# EasyEDA schematic SCH_task_B_2026-06-26.json
TITLE: Sheet_1; REV: 1.0; Date: 2026-06-25; Sheet: 1/1; Drawn By: 2001012; Company: Your Company
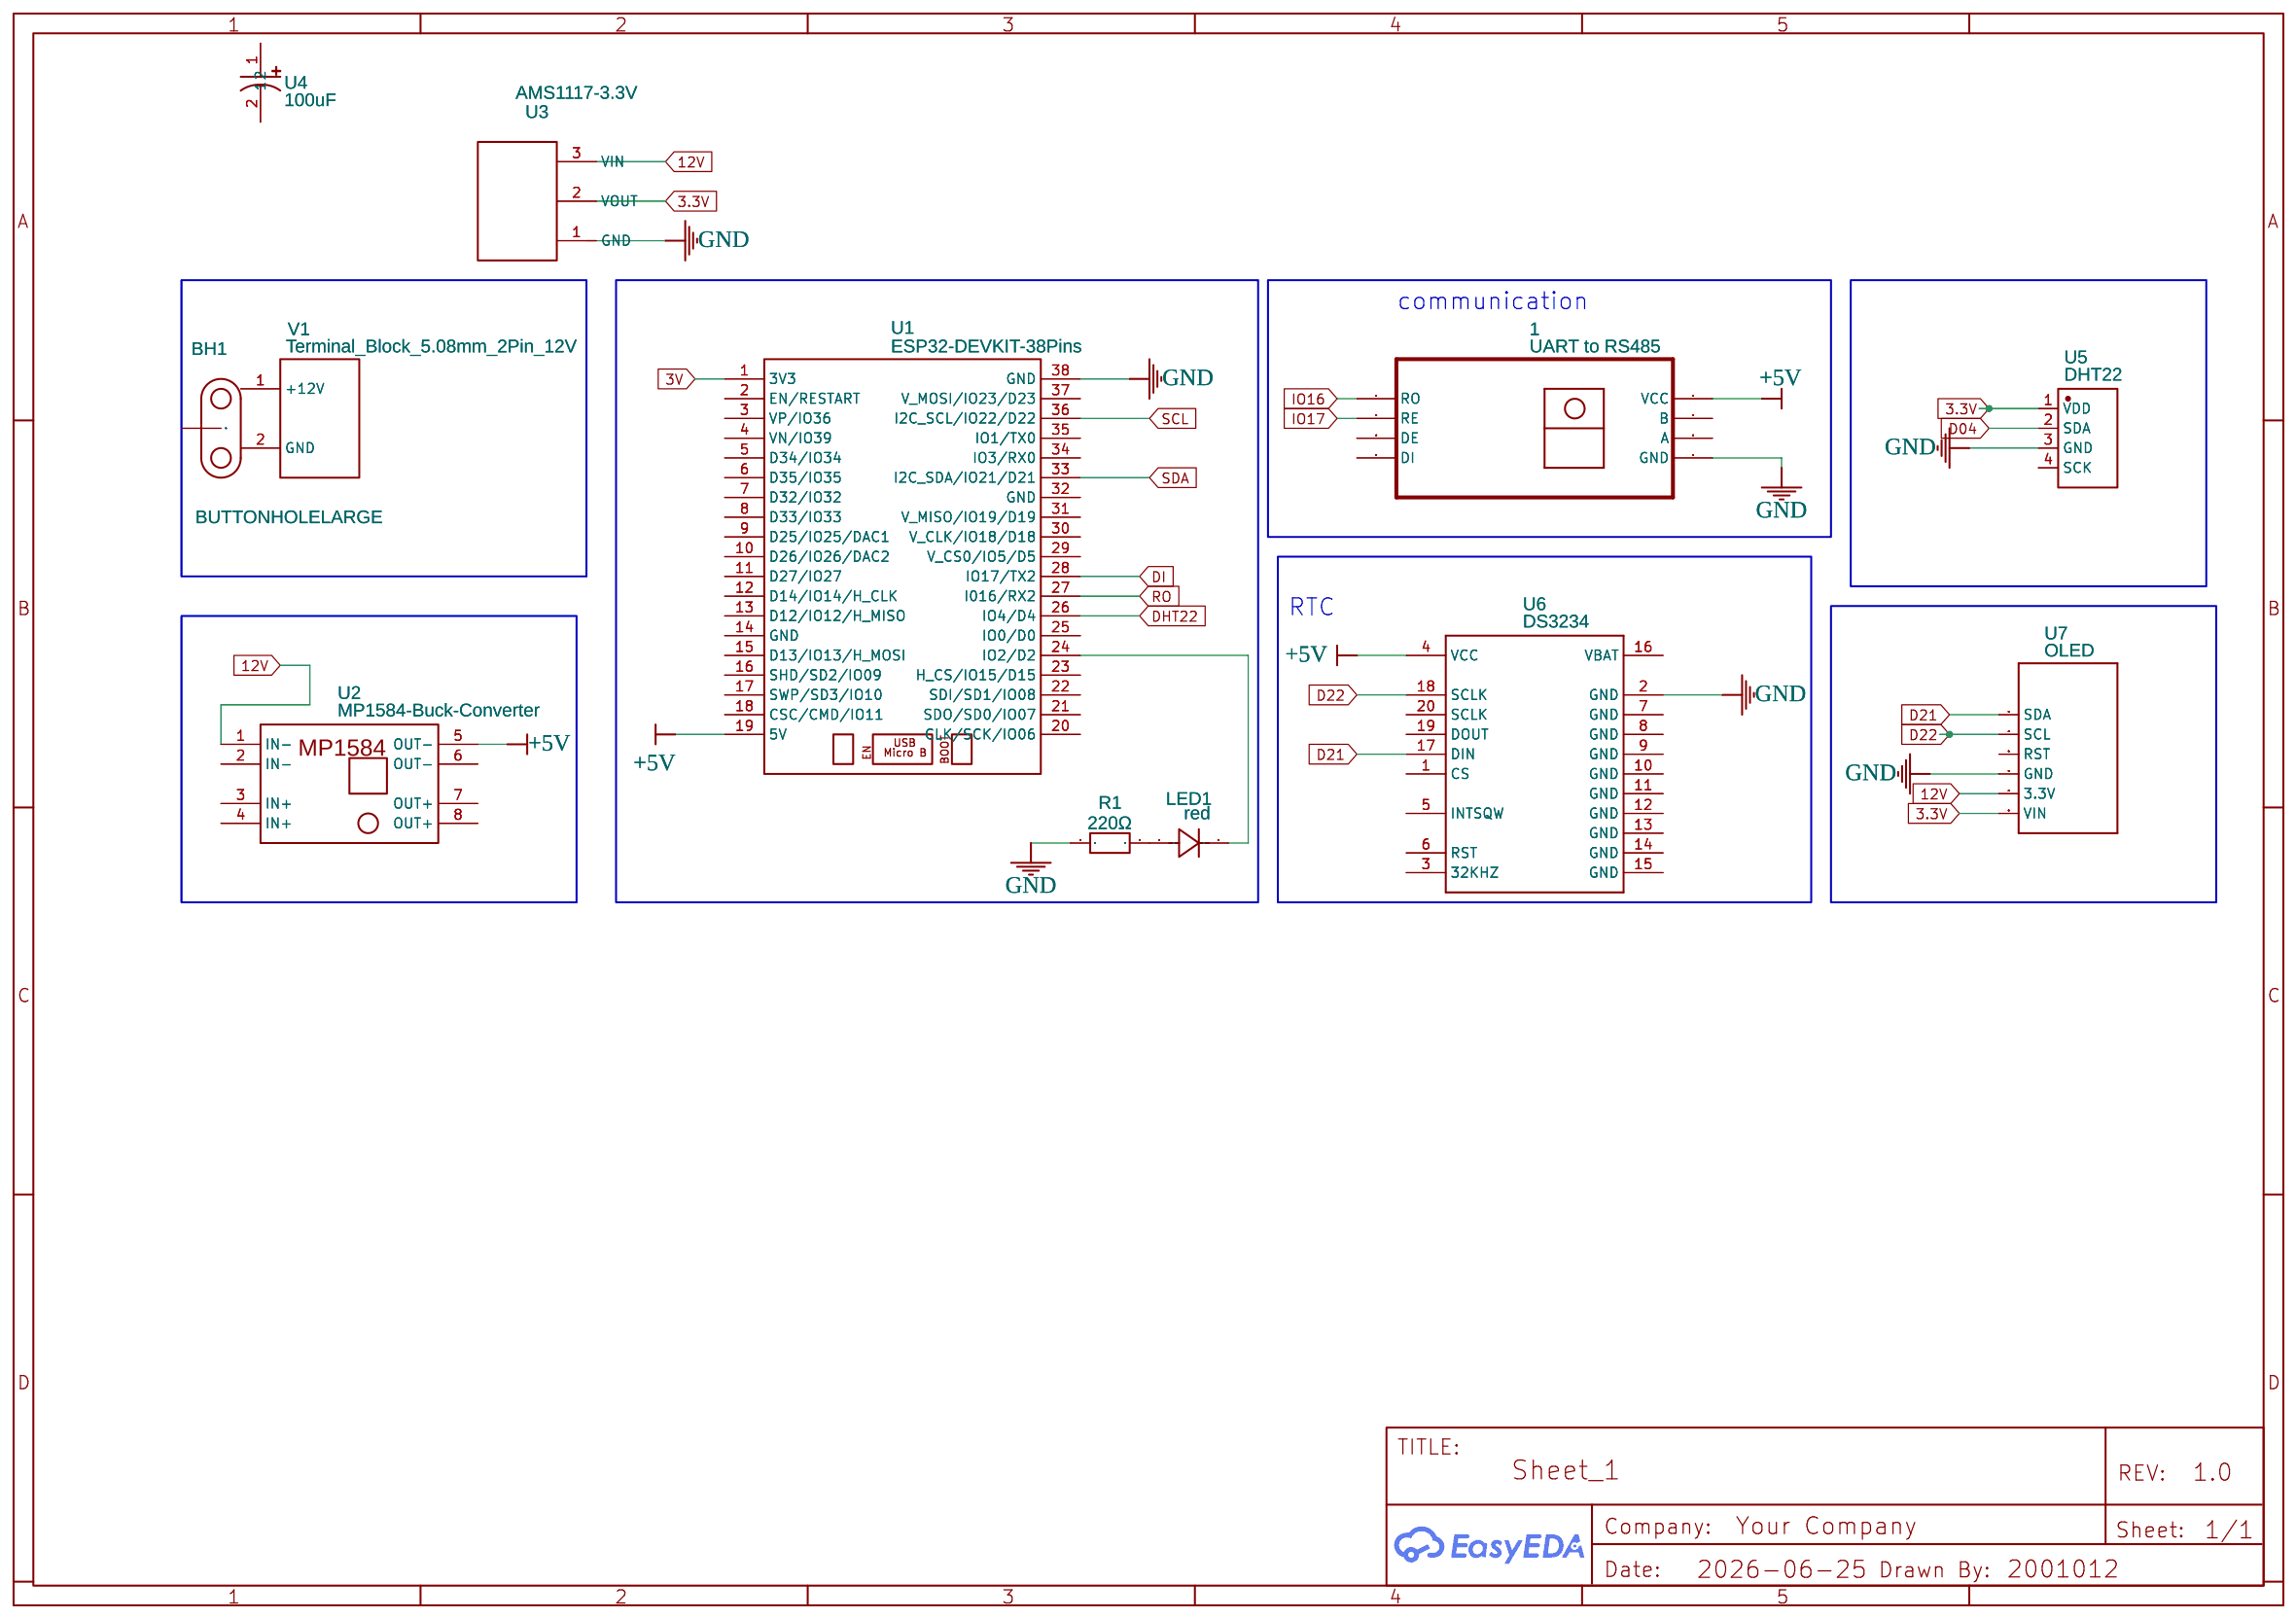
[diagram p0: schematic sheet]

## Parts
1  UART to RS485  [RS485]
BH1  BUTTONHOLELARGE  [BUTTONHOLE]
LED1  red  [LED-SMD_YLED0402O]
R1  220Ω  [RES-SMD_L28.6-W12.0_OHMITE_RWS10]
U1  ESP32-DEVKIT-38Pins  [ESP32-DEVKIT-38PINS]
U2  MP1584-Buck-Converter  [MP1584EN-BUCK-CONVERTER]
U3  AMS1117-3.3V  [3.3V STEP-UP VOLTAGE REGULATOR NCP1402]
U4  100uF  [100UF-D5XL11MM-HORN-TYPE-POLAR-ELECTROLYTIC-CAPACITORS-FP]
U5  DHT22  [SENSOR-TH_HAIGU_DHT22]
U6  DS3234  [DS3234]
U7  OLED  [ADAFRUIT_OLED_128X32]
V1  Terminal_Block_5.08mm_2Pin_12V  [TERMINAL_BLOCK_5.08MM_2PIN_12V_M2]

## Library data of the parts
1 = UART to RS485: Contributor: KM
BH1 = BUTTONHOLELARGE: Contributor: SparkFun
LED1 = YLED0402O: Supplier: LCSC; Supplier Part: C28310436; Manufacturer: YONGYUTAI(永裕泰); JLCPCB Part Class: Extended Part; Contributor: lcsc
R1 = RWS10 220R J TR: Supplier: LCSC; Supplier Part: C6460769; Manufacturer: Ohmite; Contributor: lcsc; JLCPCB Part Class: Extended Part
U1 = ESP32-DEVKIT-38Pins: Contributor: chrisjbagley
U2 = MP1584-Buck-Converter: Manufacturer Part: MP1584EN; Contributor: hirukasl6
U3 = AMS1117-3.3V: Contributor: mjlsabran
U4 = 100UF-D5XL11MM-HORN-TYPE-POLAR-ELECTROLYTIC-CAPACITORS COPY: Contributor: aades2204; Supplier: LCSC; Supplier Part: C1592120; Manufacturer: rubycon(红宝石); Manufacturer Part: 6.3NA100MEFC5X11
U5 = DHT22: Contributor: LCSC; Supplier: LCSC; Supplier Part: C2880291; Manufacturer: HAIGU(广州海谷); JLCPCB Part Class: Extended Part
U6 = DS3234: Contributor: SparkFun
U7 = ADAFRUIT_128X32_OLED
V1 = Terminal_Block_5.08mm_2Pin_12V: Contributor: RaspAutomacao

## Nets
3.3V: U5.1(VDD) U7.P$6(VIN)
3V: U1.1(3V3)
12V: U2.1(IN-) U7.P$5(3.3V)
+5V: 1.RS5(VCC) U1.19(5V) U2.5(OUT-) U6.4(VCC)
GND: 1.RS8(GND) R1.1 U1.38(GND) U5.3(GND) U6.2(GND) U7.P$4(GND)
D04: U5.2(SDA)
D21: U6.17(DIN) U7.P$1(SDA)
D22: U6.18(SCLK) U7.P$2(SCL)
DHT22: U1.26(IO4/D4)
DI: U1.28(IO17/TX2)
IO16: 1.RS1(RO)
IO17: 1.RS2(RE)
RO: U1.27(I016/RX2)
SCL: U1.36(I2C_SCL/IO22/D22)
SDA: U1.33(I2C_SDA/IO21/D21)
Net-(LED1-1): LED1.1(A) R1.2
Net-(LED1-2): LED1.2(C) U1.24(IO2/D2)

Not connected (* = marked no-connect by the designer): 1 RS3(DE) RS4(DI) RS6(B) RS7(A); BH1 P$1; U1 2(EN/RESTART) 3(VP/IO36) 4(VN/IO39) 5(D34/IO34) 6(D35/IO35) 7(D32/IO32) 8(D33/IO33) 9(D25/IO25/DAC1) 10(D26/IO26/DAC2) 11(D27/IO27) 12(D14/IO14/H_CLK) 13(D12/IO12/H_MISO) 14(GND) 15(D13/IO13/H_MOSI) 16(SHD/SD2/IO09) 17(SWP/SD3/IO10) 18(CSC/CMD/IO11) 20(CLK/SCK/IO06) 21(SDO/SD0/IO07) 22(SDI/SD1/IO08) 23(H_CS/IO15/D15) 25(IO0/D0) 29(V_CS0/IO5/D5) 30(V_CLK/IO18/D18) 31(V_MISO/IO19/D19) 32(GND) 34(IO3/RX0) 35(IO1/TX0) 37(V_MOSI/IO23/D23); U2 2(IN-) 3(IN+) 4(IN+) 6(OUT-) 7(OUT+) 8(OUT+); U3 1(GND) 2(VOUT) 3(VIN); U4 1 2; U5 4(SCK); U6 1(CS) 3(32KHZ) 5(INTSQW) 6(RST) 7(GND) 8(GND) 9(GND) 10(GND) 11(GND) 12(GND) 13(GND) 14(GND) 15(GND) 16(VBAT) 19(DOUT) 20(SCLK); U7 P$3(RST); V1 1(+12V) 2(GND)

## Notes on the sheet
- communication
- RTC
